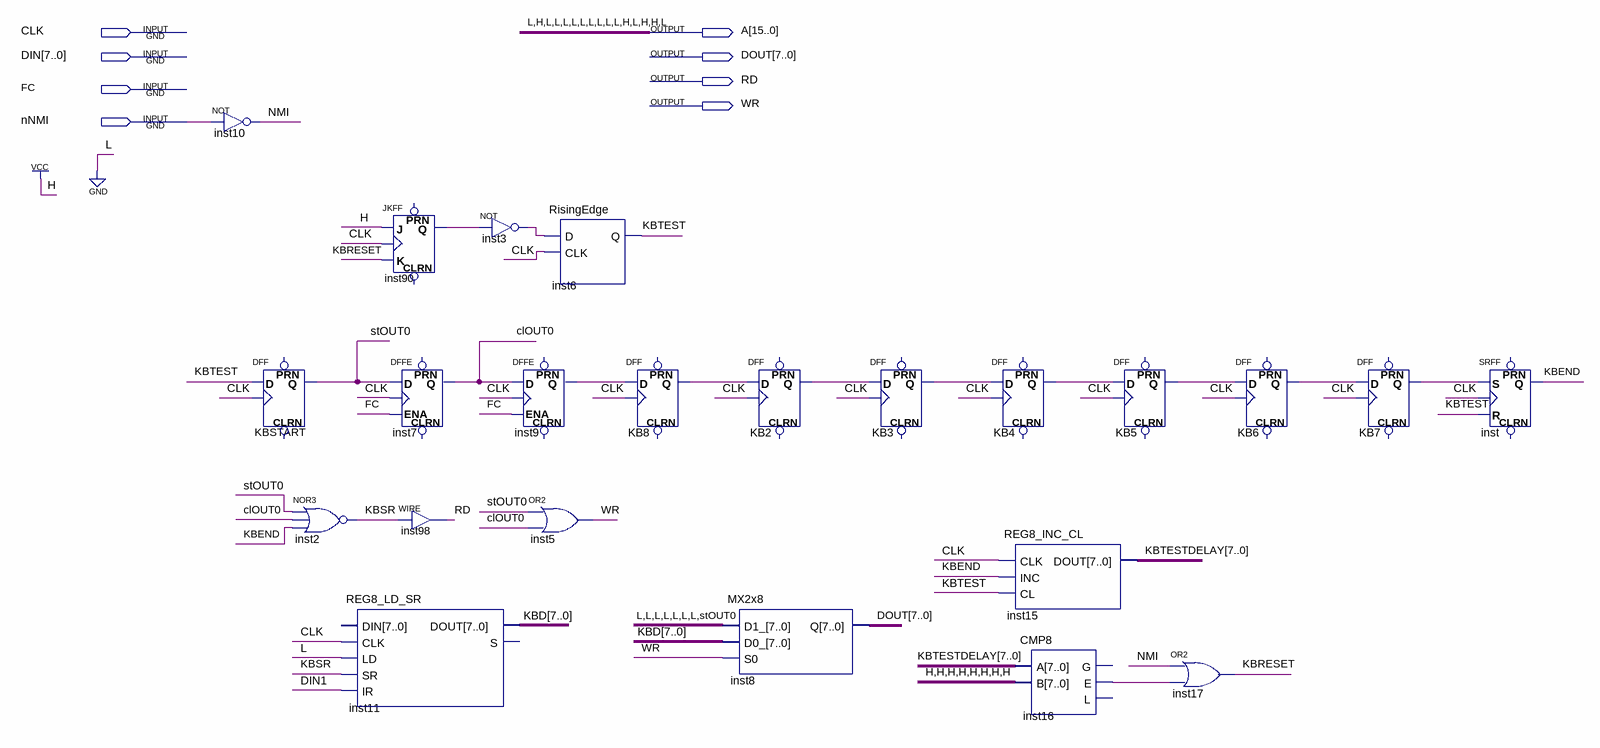
[diagram p0: schematic sheet]
// Quartus schematic KBTEST.bdf as structural Verilog: 23 symbols, 8 pins
module KBTEST (
  input  CLK,
  input  [7:0] DIN,
  input  FC,
  input  nNMI,
  output [15:0] A,
  output [7:0] DOUT,
  output RD,
  output WR
);

  wire clOUT0, inst3_out, inst9_q, inst16_e, inst90_q, KB2_q, KB3_q, KB4_q, KB5_q, KB6_q, KB7_q, KB8_q,
       KBEND, KBRESET, KBSR, KBTEST, NMI, stOUT0;
  wire [7:0] KBD, KBTESTDELAY;

  not inst10 (NMI, nNMI);
  DFF KBSTART (.CLK(CLK), .D(KBTEST), .Q(stOUT0));  // open: CLRN, PRN
  nor inst2 (KBSR, stOUT0, clOUT0, KBEND);
  REG8_LD_SR inst11 (.CLK(CLK), .LD(1'b0), .SR(KBSR), .IR(DIN[1]), .DOUT(KBD));  // open: DIN, S
  JKFF inst90 (.K(KBRESET), .J(1'b1), .CLK(CLK), .Q(inst90_q));  // open: PRN, CLRN
  DFFE inst7 (.D(stOUT0), .CLK(CLK), .ENA(FC), .Q(clOUT0));  // open: PRN, CLRN
  assign RD = KBSR;  // WIRE inst98
  not inst3 (inst3_out, inst90_q);
  RisingEdge inst6 (.D(inst3_out), .CLK(CLK), .Q(KBTEST));
  DFFE inst9 (.D(clOUT0), .CLK(CLK), .ENA(FC), .Q(inst9_q));  // open: PRN, CLRN
  or inst5 (WR, stOUT0, clOUT0);
  DFF KB8 (.CLK(CLK), .D(inst9_q), .Q(KB8_q));  // open: CLRN, PRN
  DFF KB2 (.CLK(CLK), .D(KB8_q), .Q(KB2_q));  // open: CLRN, PRN
  MX2x8 inst8 (.D1_({{7{1'b0}}, stOUT0}), .D0_(KBD), .S0(WR), .Q(DOUT));
  DFF KB3 (.CLK(CLK), .D(KB2_q), .Q(KB3_q));  // open: CLRN, PRN
  DFF KB4 (.CLK(CLK), .D(KB3_q), .Q(KB4_q));  // open: CLRN, PRN
  REG8_INC_CL inst15 (.CLK(CLK), .INC(KBEND), .CL(KBTEST), .DOUT(KBTESTDELAY));
  CMP8 inst16 (.A(KBTESTDELAY), .B({8{1'b1}}), .E(inst16_e));  // open: G, L
  DFF KB5 (.CLK(CLK), .D(KB4_q), .Q(KB5_q));  // open: CLRN, PRN
  or inst17 (KBRESET, NMI, inst16_e);
  DFF KB6 (.CLK(CLK), .D(KB5_q), .Q(KB6_q));  // open: CLRN, PRN
  DFF KB7 (.CLK(CLK), .D(KB6_q), .Q(KB7_q));  // open: CLRN, PRN
  SRFF inst (.S(KB7_q), .R(KBTEST), .CLK(CLK), .Q(KBEND));  // open: PRN, CLRN

  assign A = 16'b0100000000010110;
endmodule
